# Altium project PiezoControlBoard.PrjPcb (part 1 of 2)
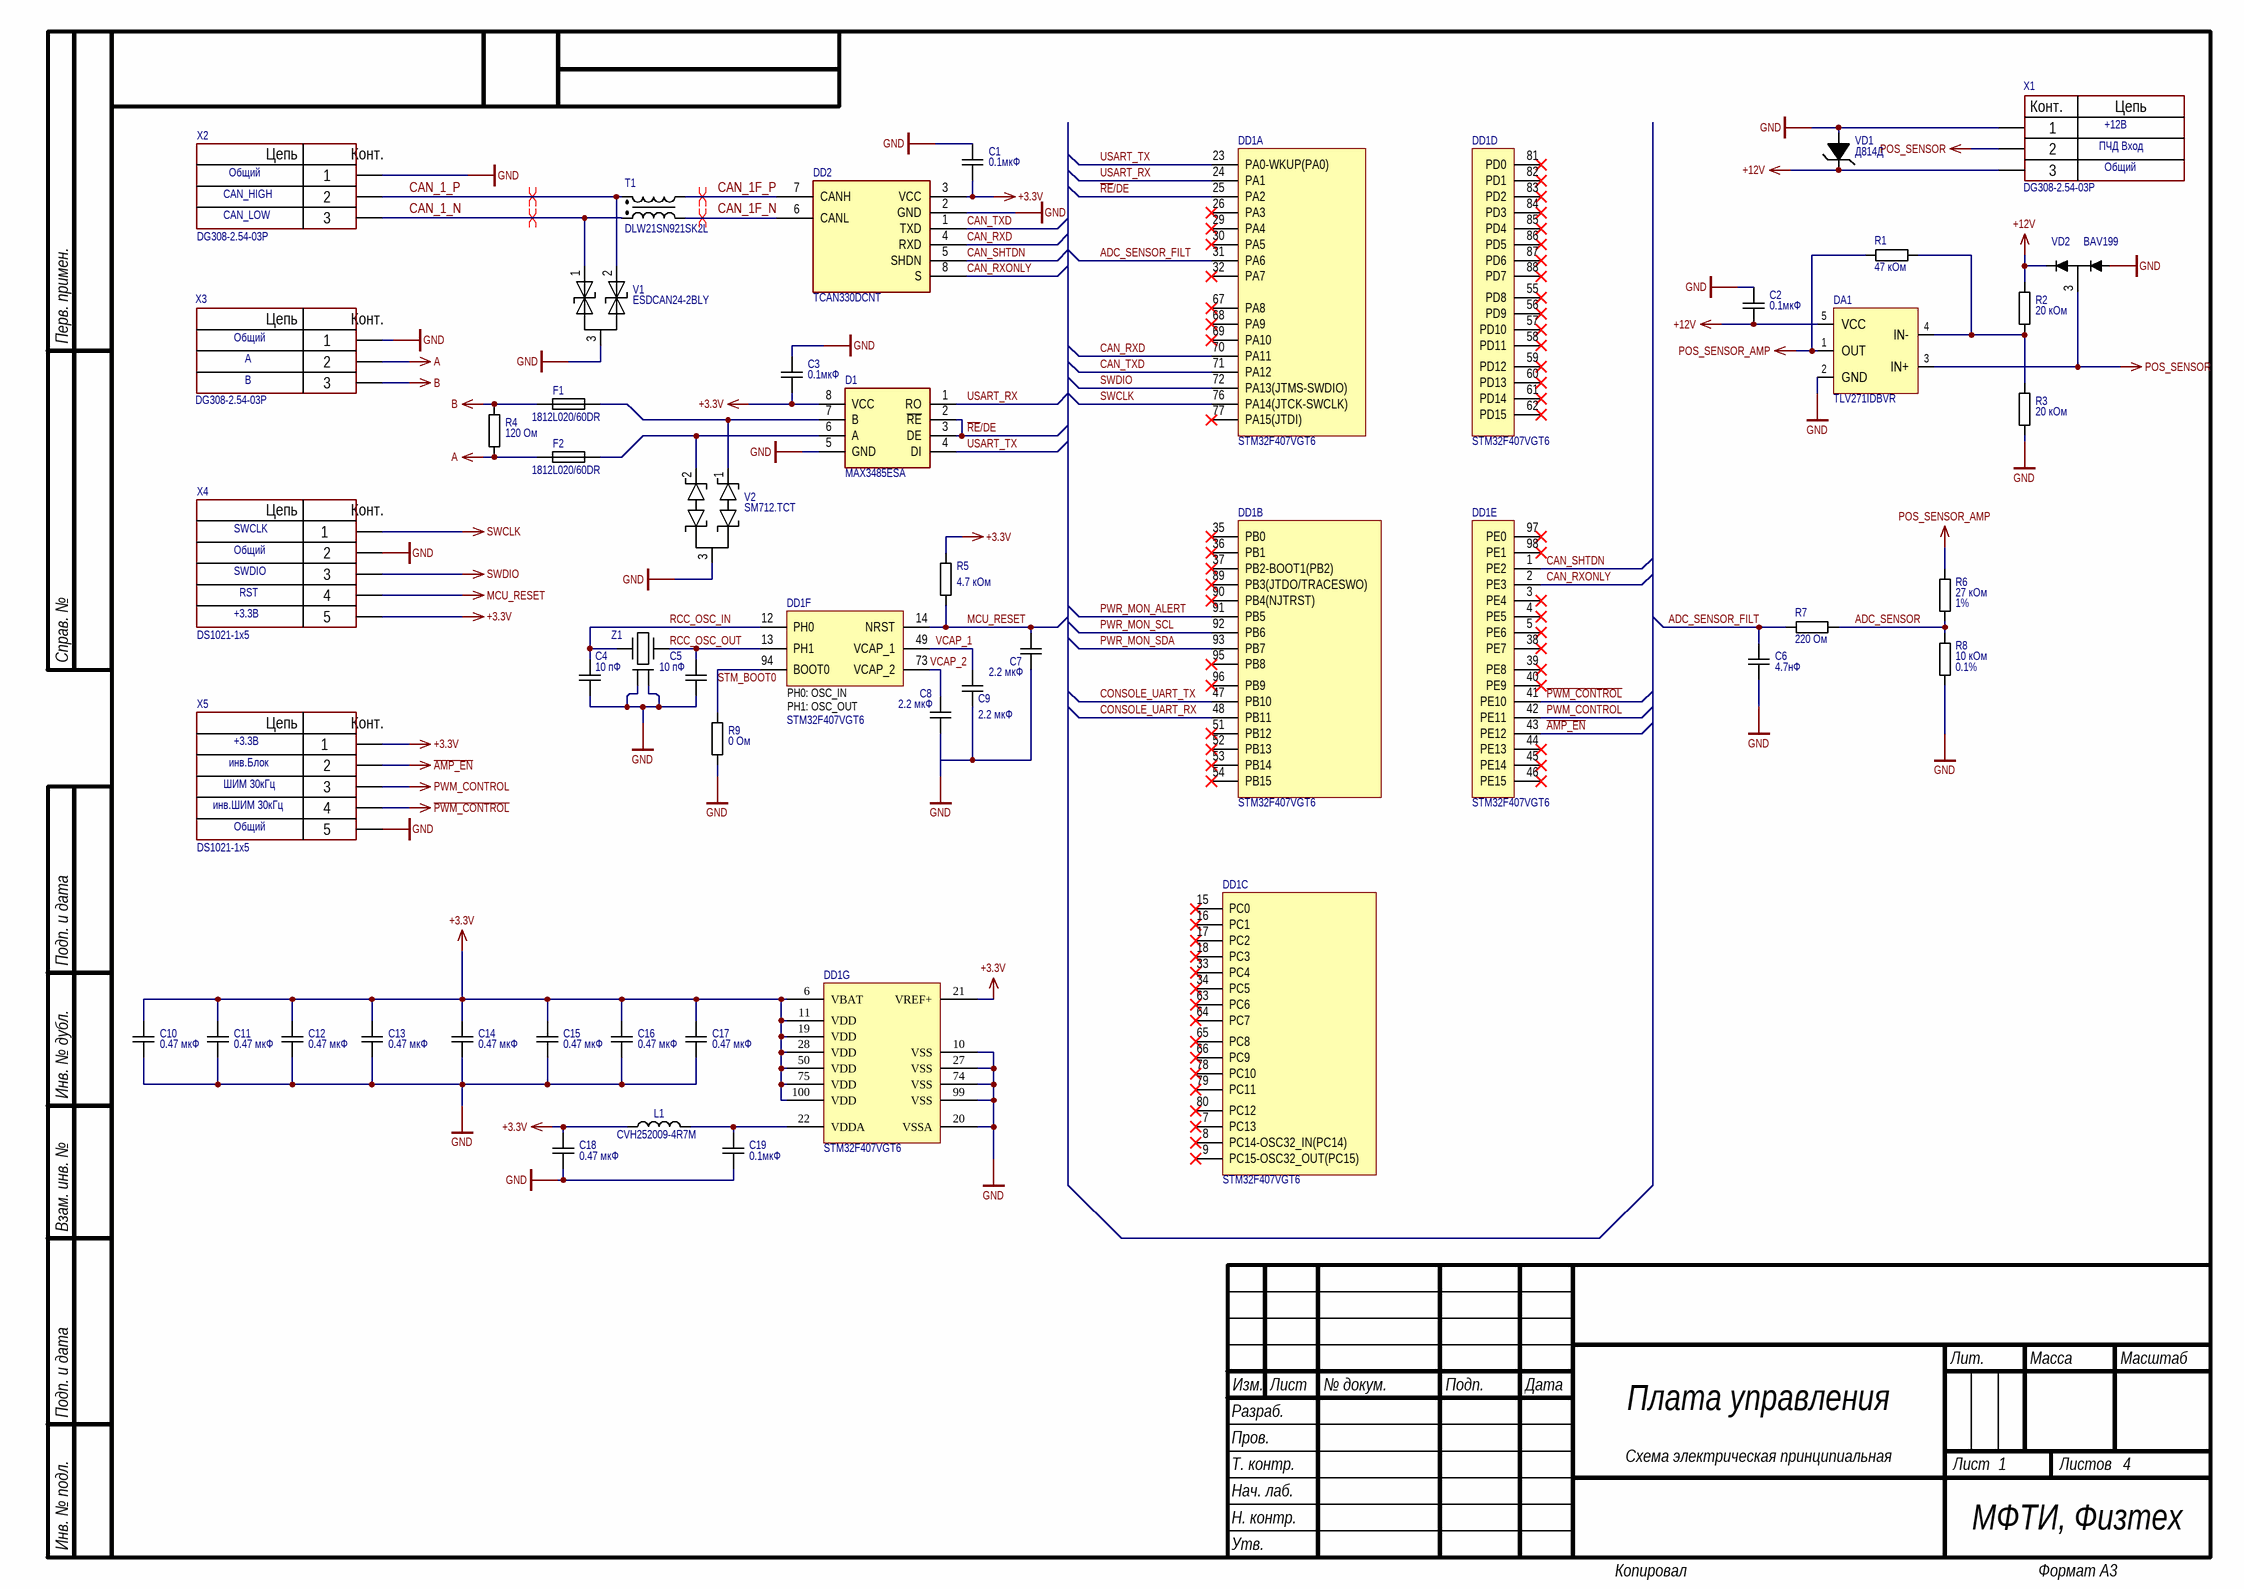
[diagram p0: MCU_Control.SchDoc]
DocumentScale: 2:1
4 sheets, 144 parts. Net scope: global (net labels, ports and power ports of the same name join across sheets).
Board file: PiezoControlBoard.PcbDoc
Sheets:
  MCU_Control.SchDoc
  Power_Management.SchDoc
  HV_Piezo_Driver.SchDoc
  Console.SchDoc

## Sheet MCU_Control.SchDoc: Плата управления
size 419 x 297 mm; Organization: МФТИ, Физтех; SheetNumber: 1; SheetTotal: 4; SchemeType: Схема электрическая принципиальная

### Parts
(Parts that share a designator on the sheet are numbered #1, #2 ... from top to bottom, then left to right.)
C1  value 0.1мкФ  [CAP-0402]  (hidden comment: CAP-0.1мкФ-10%-25В-X7R-0402)
C2  value 0.1мкФ  [CAP-0402]  (hidden comment: CAP-0.1мкФ-10%-25В-X7R-0402)
C3  value 0.1мкФ  [CAP-0402]  (hidden comment: CAP-0.1мкФ-10%-25В-X7R-0402)
C4  value 10 пФ  [CAP-0402]  (hidden comment: CAP-10 пФ-5%-50 В-NP0-0402)
C5  value 10 пФ  [CAP-0402]  (hidden comment: CAP-10 пФ-5%-50 В-NP0-0402)
C6  value 4.7нФ  [CAP-0805]  (hidden comment: CAP-4.7нФ-5%-50В-C0G-0805)
C7  value 2.2 мкФ  [CAP-0603]  (hidden comment: CAP-2.2 мкФ-10%-25 В-X5R-0603)
C8  value 2.2 мкФ  [CAP-0603]  (hidden comment: CAP-2.2 мкФ-10%-25 В-X5R-0603)
C9  value 2.2 мкФ  [CAP-0603]  (hidden comment: CAP-2.2 мкФ-10%-25 В-X5R-0603)
C10  value 0.47 мкФ  [CAP-0402]  (hidden comment: CAP-0.47 мкФ-10%-25 В-X5R-0402)
C11  value 0.47 мкФ  [CAP-0402]  (hidden comment: CAP-0.47 мкФ-10%-25 В-X5R-0402)
C12  value 0.47 мкФ  [CAP-0402]  (hidden comment: CAP-0.47 мкФ-10%-25 В-X5R-0402)
C13  value 0.47 мкФ  [CAP-0402]  (hidden comment: CAP-0.47 мкФ-10%-25 В-X5R-0402)
C14  value 0.47 мкФ  [CAP-0402]  (hidden comment: CAP-0.47 мкФ-10%-25 В-X5R-0402)
C15  value 0.47 мкФ  [CAP-0402]  (hidden comment: CAP-0.47 мкФ-10%-25 В-X5R-0402)
C16  value 0.47 мкФ  [CAP-0402]  (hidden comment: CAP-0.47 мкФ-10%-25 В-X5R-0402)
C17  value 0.47 мкФ  [CAP-0402]  (hidden comment: CAP-0.47 мкФ-10%-25 В-X5R-0402)
C18#1  value 0.47 мкФ  [CAP-0402]  (hidden comment: CAP-0.47 мкФ-10%-25 В-X5R-0402)
C19#1  value 0.1мкФ  [CAP-0402]  (hidden comment: CAP-0.1мкФ-10%-25В-X7R-0402)
D1  MAX3485ESA  [SOIC-8]
DA1  TLV271IDBVR  [SOT-23-5]
DD1  STM32F407VGT6  [LQFP-100]  (parts A,B,C,D,E,F,G of 7)
DD2  TCAN330DCNT  [SOT-23-8]
F1  1812L020/60DR  [SMD-1812]
F2  1812L020/60DR  [SMD-1812]
L1  4.7 мкГн  [IND_1008]  (value not drawn)
R1  value 47 кОм  [RES-0603]  (hidden comment: RES-47 кОм-1%-0.1Вт-0603)
R2  value 20 кОм  [RES-0603]  (hidden comment: RES-20 кОм-1%-0.1Вт-0603)
R3  value 20 кОм  [RES-0603]  (hidden comment: RES-20 кОм-1%-0.1Вт-0603)
R4#1  value 120 Ом  [RES-0402]  (hidden comment: RES-120 Ом-1%-0.062Вт-0402)
R5#1  value 4.7 кОм  [RES-0402]  (hidden comment: RES-4.7 кОм-5%-0.062 Вт-0402)
R6#1  value 27 кОм  Tolerance: 1%  [RES-0603]  (hidden comment: RES-27 кОм-1%-0.1Вт-0603)
R7#1  value 220 Ом  [RES-0603]  (hidden comment: RES-220 Ом-1%-0.1Вт-0603)
R8#1  value 10 кОм  Tolerance: 0.1%  [RES-0603]  (hidden comment: RES-10 кОм-0.1%-0.1Вт-0603)
R9#1  value 0 Ом  [RES-0402]  (hidden comment: RES-0 Ом-5%-0.062 Вт-0402)
T1  DLW21SN921SK2L  [DLW21S]
V1  ESDCAN24-2BLY  [SOT23-3L]
V2  SM712.TCT  [SOT-23]
VD1#1  Д814Д  [КД-8]
VD2#1  BAV199  [SOT-23-3]
X1  DG308-2.54-03P  Curciut 3: +12В  Curciut 2: ПЧД Вход  Curciut 1: Общий  [DG30825403P1400AH]
X2  DG308-2.54-03P  Curciut 3: CAN_LOW  Curciut 2: CAN_HIGH  Curciut 1: Общий  [DG30825403P1400AH]
X3  DG308-2.54-03P  Curciut 3: B  Curciut 2: A  Curciut 1: Общий  [DG30825403P1400AH]
X4  DS1021-1x5  Curciut 5: +3.3В  Curciut 4: RST  Curciut 3: SWDIO  Curciut 2: Общий  Curciut 1: SWCLK  [DS1021-1x5]
X5#1  DS1021-1x5  Curciut 5: Общий  Curciut 4: инв.ШИМ 30кГц  Curciut 3: ШИМ 30кГц  Curciut 2: инв.Блок  Curciut 1: +3.3В  [DS1021-1x5]
Z1  ABM11-25.000MHZ-D2X-T  [ABM11]  (value not drawn)

### Nets
+3.3V: C1.1 C3.1 C10.1 C11.1 C12.1 C13.1 C14.1 C15.1 C16.1 C17.1 C18#1.1 D1.8(VCC) DD1.6(VBAT) DD1.11(VDD) DD1.19(VDD) DD1.21(VREF+) DD1.28(VDD) DD1.50(VDD) DD1.75(VDD) DD1.100(VDD) DD2.3(VCC) L1.1 R5#1.2 X4.5 X5#1.1
+12V: C2.1 DA1.5(VCC) R2.2 VD1#1.C VD2#1.2 X1.3
A: F2.1 R4#1.1 X3.2
~{AMP_EN}: DD1.43(PE12) X5#1.2
B: F1.1 R4#1.2 X3.3
CONSOLE_UART_RX: DD1.48(PB11)
CONSOLE_UART_TX: DD1.47(PB10)
GND: C1.2 C2.2 C3.2 C4.1 C5.1 C6.1 C7.1 C8.1 C9.1 C10.2 C11.2 C12.2 C13.2 C14.2 C15.2 C16.2 C17.2 C18#1.2 C19#1.1 D1.5(GND) DA1.2(GND) DD1.10(VSS) DD1.20(VSSA) DD1.27(VSS) DD1.74(VSS) DD1.99(VSS) DD2.2(GND) R3.1 R8#1.1 R9#1.1 V1.3 V2.3 VD1#1.A VD2#1.1 X1.1 X2.1 X3.1 X4.2 X5#1.5 Z1.2 Z1.4
MCU_RESET: C7.2 DD1.14(NRST) R5#1.1 X4.4
~{PWM_CONTROL}: DD1.41(PE10) X5#1.4
POS_SENSOR: DA1.3(IN+) VD2#1.3 X1.2
POS_SENSOR_AMP: DA1.1(OUT) R1.2 R6#1.2
PWM_CONTROL: DD1.42(PE11) X5#1.3
PWR_MON_ALERT: DD1.91(PB5)
PWR_MON_SCL: DD1.92(PB6)
PWR_MON_SDA: DD1.93(PB7)
SWCLK: DD1.76(PA14(JTCK-SWCLK)) X4.1
SWDIO: DD1.72(PA13(JTMS-SWDIO)) X4.3
~{RE}/DE: D1.2(~{RE}) D1.3(DE) DD1.25(PA2)
ADC_SENSOR: R6#1.1 R7#1.1 R8#1.2
ADC_SENSOR_FILT: C6.2 DD1.31(PA6) R7#1.2
CAN_1_N: T1.1 V1.1 X2.3
CAN_1_P: T1.4 V1.2 X2.2
CAN_1F_N: DD2.6(CANL) T1.2
CAN_1F_P: DD2.7(CANH) T1.3
CAN_RXD: DD1.70(PA11) DD2.4(RXD)
CAN_RXONLY: DD1.2(PE3) DD2.8(S)
CAN_SHTDN: DD1.1(PE2) DD2.5(SHDN)
CAN_TXD: DD1.71(PA12) DD2.1(TXD)
RCC_OSC_IN: C4.2 DD1.12(PH0) Z1.1(OSC1)
RCC_OSC_OUT: C5.2 DD1.13(PH1) Z1.3(OSC2)
STM_BOOT0: DD1.94(BOOT0) R9#1.2
USART_RX: D1.1(RO) DD1.24(PA1)
USART_TX: D1.4(DI) DD1.23(PA0-WKUP(PA0))
VCAP_1: C9.2 DD1.49(VCAP_1)
VCAP_2: C8.2 DD1.73(VCAP_2)
NetC19#1_2: C19#1.2 DD1.22(VDDA) L1.2
NetD1_6: D1.6(A) F2.2 V2.2
NetD1_7: D1.7(B) F1.2 V2.1
NetDA1_4: DA1.4(IN-) R1.1 R2.1 R3.2

Not connected (* = marked no-connect by the designer): DD1 3(PE4)* 4(PE5)* 5(PE6)* 7(PC13)* 8(PC14-OSC32_IN(PC14))* 9(PC15-OSC32_OUT(PC15))* 15(PC0)* 16(PC1)* 17(PC2)* 18(PC3)* 26(PA3)* 29(PA4)* 30(PA5)* 32(PA7)* 33(PC4)* 34(PC5)* 35(PB0)* 36(PB1)* 37(PB2-BOOT1(PB2))* 38(PE7)* 39(PE8)* 40(PE9)* 44(PE13)* 45(PE14)* 46(PE15)* 51(PB12)* 52(PB13)* 53(PB14)* 54(PB15)* 55(PD8)* 56(PD9)* 57(PD10)* 58(PD11)* 59(PD12)* 60(PD13)* 61(PD14)* 62(PD15)* 63(PC6)* 64(PC7)* 65(PC8)* 66(PC9)* 67(PA8)* 68(PA9)* 69(PA10)* 77(PA15(JTDI))* 78(PC10)* 79(PC11)* 80(PC12)* 81(PD0)* 82(PD1)* 83(PD2)* 84(PD3)* 85(PD4)* 86(PD5)* 87(PD6)* 88(PD7)* 89(PB3(JTDO/TRACESWO))* 90(PB4(NJTRST))* 95(PB8)* 96(PB9)* 97(PE0)* 98(PE1)*

### Layout directives
differential pair: CAN_1_N, CAN_1_P, CAN_1F_N, CAN_1F_P

### Notes on the sheet
- Перв. примен.
- Справ. №
- Подп. и дата
- Инв. № дубл.
- Взам. инв. №
- Разраб.
- Изм.
- Лист
- № докум.
- Подп.
- Дата
- Лит.
- Масса
- Масштаб
- Пров.
- Т. контр.
- Листов
- Н. контр.
- Утв.
- Нач. лаб.
- Инв. № подл.
- Копировал
- Формат А3
- (in symbol DG308-2.54-03P) Цепь; Конт.
- (in symbol DS1021-1x5) Цепь; Конт.
- (in symbol STM32F407VGT6, part F) PH0: OSC_IN; PH1: OSC_OUT

### Library data of the parts
C1-C3 C19#1 = Cap_0402: Конденсатор; Manufacturer Part Number: GRM155R71E104KE14D; Tolerance: 10%; Voltage: 25В; Supplier 1: https://www.chipdip.ru/product/grm155r71e104ke14d-murata; Temperature: X7R
C4 C5 = Cap_0402: Конденсатор; Manufacturer Part Number: GRM1535C1H100JDD5D; Tolerance: 5%; Voltage: 50 В; Supplier 1: https://www.chipdip.ru/product/grm1535c1h100j; Temperature: NP0
C6 = Cap_0805: Конденсатор; Manufacturer Part Number: GRM2165C1H472JA01D; Tolerance: 5%; Voltage: 50В; Temperature: C0G; Supplier 1: https://www.chipdip.ru/product/grm2165c1h472ja01d-kondensator-keramicheskiy-mlcc-murata-8016016109
C7-C9 = Cap_0603: Конденсатор; Manufacturer Part Number: GRM188R61E225KA12D; Tolerance: 10%; Voltage: 25 В; Temperature: X5R; Supplier 1: https://www.chipdip.ru/product/grm188r61e225ka12d-murata
C10-C17 C18#1 = Cap_0402: Конденсатор керамический 25 В, 0.47 мкФ ±10%, X5R, 0402, -55...85 °C; Manufacturer Part Number: GRT155R61E474KE01D; Voltage: 25 В; Supplier 1: https://www.chipdip.ru/product/grm21br71e474k; Tolerance: 10%; Temperature: X5R
D1 = MAX3485ESA+: Single Transmitter/Receiver RS-422/RS-485 8-Pin SOIC N; Manufacturer: Maxim; Supplier 1: https://www.chipdip.ru/product/max3485eesa-t-maxim; Supplier Part Number: 2518818; Manufacturer Part Number: MAX3485ESA+; RoHS: Yes; Category: RS-232 / RS-422 / RS-485 Interface ICs; Stock: 707; Pricing: 1=6,17, 10=5,32, 25=4,97, 100=4,61, 300=4,41, 500=4,01, 1000=3,52 (EUR); ComponentLink1URL: https://datasheet.ciiva.com/14424/max3483-max3491-14424938.pdf?src-supplier=Avnet; ComponentLink1Description: https://datasheet.ciiva.com/14424/max3483-max3491-14424938.pdf?src-supplier=Avnet; ComponentLink2URL: https://datasheet.ciiva.com/1714/max3483-max3491-1714122.pdf?src-supplier=Digikey; ComponentLink2Description: https://datasheet.ciiva.com/1714/max3483-max3491-1714122.pdf?src-supplier=Digikey
DA1 = TLV271IDBVR: Single Rail-to-Rail Operational Amplifier, SOT-23, TLV271IDBVR; Manufacturer: Texas Instruments; Manufacturer Lifecycle Status: ACTIVE; Bandwidth: 3MHz; Common Mode Rejection Ratio: 69dB; Dual Supply Voltage: 5V; Input Bias Current: 60pA; Input Offset Voltage (Vos): 5mV; Max Dual Supply Voltage: 8V; Max Power Dissipation: 201mW; Max Supply Voltage: 16V; Min Dual Supply Voltage: 1.35V; Min Supply Voltage: 2.7V; Nominal Supply Current: 800µA; Number of Amplifiers: 1; Operating Supply Current: 625µA; Output Current: 13mA; Power Supply Rejection Ratio (PSRR): 70dB; Slew Rate: 2.4V/µs; Voltage Gain: 110dB; Supplier: RS; Supplier Part Number: 2184654; Manufacturer Part Number: TLV271IDBVR; RoHS: Compliant; Category: Amplifiers - Op Amps, Buffer, Instrumentation; Stock: 1000; Pricing: 10=0,505, 50=0,479, 100=0,432, 250=0,388, 500=0,369 (GBP); Case/Package: SOT-23; Contact Plating: Gold; Gain Bandwidth Product: 3MHz; Height: 1.45mm; Lead Free: Lead Free; Length: 2.9mm; Lifecycle Status: Production; Max I/O Voltage: 5mV; Max Operating Temperature: 125°C; Min Operating Temperature: -40°C; Nominal Gain Bandwidth Product: 3MHz; Number of Channels: 1; Number of Circuits: 1; Number of Elements: 1; Pins: 5; Operating Supply Voltage: 5V; Output Current per Channel: 13mA; Packaging: Cut Tape; Power Dissipation: 201mW; Radiation Hardening: No; REACH SVHC: No; Schedule B: 8542330000, 8542330000|8542330000|8542330000|8542330000|8542330000|8542330000|8542330000|8542330000|8542330000|8542330000|8542330000|8542330000|8542330000|8542330000|8542330000|8542330000|8542330000|8542330000|8542330000|8542330000|8542330000|8542330000|8542330000|85; Thickness: 1.2mm; Width: 1.6mm; ComponentLink1URL: https://sigma.octopart.com:443/177332311/technical_drawing/Texas-Instruments-TLV271IDBVR.pdf?src-supplier=Texas+Instruments; ComponentLink1Description: https://sigma.octopart.com:443/177332311/technical_drawing/Texas-Instruments-TLV271IDBVR.pdf?src-supplier=Texas+Instruments; ComponentLink2URL: https://octopart.com:443/opatz8j6/c1?t=xcKfiJBWjAmYsTfbSL-CzoOmzwEvjnPfYfSv82HYzKGs_6IgCZ6Y4Z1lF1bvJzEv39QWfXGgcZZnnapJK-Oyrd-ym6EThaYOJfbjIdY0gNOgQgkvB5ipi4TQKB-N_9Z4aF8oC4FEWWO1qQbGN_gEN6aHITD1x1gqD40gQs_ZLOpQbD32bAUiak8d48dFHYI_buWggoNQNLuwFJQIcVLm9iYp2q-f2WXUrehkCiEZXZGpi4kEl-P_ikKun8CbEnyYrMhl2WVMGYe1UiE5g9ZjThNOC2j0NOontvZ9pDSM0E2NdS-KvLoF94xRgWqBDz3UjNI_t0gqBymYZUMiW6_Jo37IGL5BO-oa7doWszXX2JJOG4V0X3qSIiHL2dBw451RtRk&src-supplier=Texas+Instruments; ComponentLink2Description: https://octopart.com:443/opatz8j6/c1?t=xcKfiJBWjAmYsTfbSL-CzoOmzwEvjnPfYfSv82HYzKGs_6IgCZ6Y4Z1lF1bvJzEv39QWfXGgcZZnnapJK-Oyrd-ym6EThaYOJfbjIdY0gNOgQgkvB5ipi4TQKB-N_9Z4aF8oC4FEWWO1qQbGN_gEN6aHITD1x1gqD40gQs_ZLOpQbD32bAUiak8d48dFHYI_buWggoNQNLuwFJQIcVLm9iYp2q-f2WXUrehkCiEZXZGpi4kEl-P_ikKun8CbEnyYrMhl2WVMGYe1UiE5g9ZjThNOC2j0NOontvZ9pDSM0E2NdS-KvLoF94xRgWqBDz3UjNI_t0gqBymYZUMiW6_Jo37IGL5BO-oa7doWszXX2JJOG4V0X3qSIiHL2dBw451RtRk&src-supplier=Texas+Instruments; ComponentLink3URL: https://sigma.octopart.com:443/175570406/technical_drawing/Texas-Instruments-TLV271IDBVR.pdf?src-supplier=Texas+Instruments; ComponentLink3Description: https://sigma.octopart.com:443/175570406/technical_drawing/Texas-Instruments-TLV271IDBVR.pdf?src-supplier=Texas+Instruments; ComponentLink4URL: https://sigma.octopart.com:443/169406034/technical_drawing/Texas-Instruments-TLV271IDBVR.pdf?src-supplier=Texas+Instruments; ComponentLink4Description: https://sigma.octopart.com:443/169406034/technical_drawing/Texas-Instruments-TLV271IDBVR.pdf?src-supplier=Texas+Instruments; ComponentLink5URL: https://sigma.octopart.com:443/155939316/technical_drawing/Texas-Instruments-TLV271IDBVR.pdf?src-supplier=Texas+Instruments; ComponentLink5Description: https://sigma.octopart.com:443/155939316/technical_drawing/Texas-Instruments-TLV271IDBVR.pdf?src-supplier=Texas+Instruments; ComponentLink6URL: https://sigma.octopart.com:443/102331370/technical_drawing/Texas-Instruments-TLV271IDBVR.pdf?src-supplier=Texas+Instruments; ComponentLink6Description: https://sigma.octopart.com:443/102331370/technical_drawing/Texas-Instruments-TLV271IDBVR.pdf?src-supplier=Texas+Instruments; ComponentLink7URL: https://sigma.octopart.com:443/49249325/technical_drawing/Texas-Instruments-TLV271IDBVR.pdf?src-supplier=Texas+Instruments; ComponentLink7Description: https://sigma.octopart.com:443/49249325/technical_drawing/Texas-Instruments-TLV271IDBVR.pdf?src-supplier=Texas+Instruments; ComponentLink8URL: https://datasheet.octopart.com:443/TLV271IDBVR-Texas-Instruments-datasheet-151134.pdf?src-supplier=Texas+Instruments; ComponentLink8Description: https://datasheet.octopart.com:443/TLV271IDBVR-Texas-Instruments-datasheet-151134.pdf?src-supplier=Texas+Instruments; ComponentLink9URL: https://datasheet.octopart.com:443/TLV271IDBVR-Texas-Instruments-datasheet-11536657.pdf?src-supplier=Upverter; ComponentLink9Description: https://datasheet.octopart.com:443/TLV271IDBVR-Texas-Instruments-datasheet-11536657.pdf?src-supplier=Upverter; ComponentLink10URL: https://datasheet.octopart.com:443/TLV271IDBVR.-Texas-Instruments-datasheet-66581739.pdf?src-supplier=element14+APAC; ComponentLink10Description: https://datasheet.octopart.com:443/TLV271IDBVR.-Texas-Instruments-datasheet-66581739.pdf?src-supplier=element14+APAC; ComponentLink11URL: https://datasheet.octopart.com:443/TLV271IDBVR.-Texas-Instruments-datasheet-62088949.pdf?src-supplier=element14+APAC; ComponentLink11Description: https://datasheet.octopart.com:443/TLV271IDBVR.-Texas-Instruments-datasheet-62088949.pdf?src-supplier=element14+APAC; ComponentLink12URL: https://datasheet.octopart.com:443/TLV271IDBVR.-Texas-Instruments-datasheet-37735837.pdf?src-supplier=Farnell; ComponentLink12Description: https://datasheet.octopart.com:443/TLV271IDBVR.-Texas-Instruments-datasheet-37735837.pdf?src-supplier=Farnell; ComponentLink13URL: https://datasheet.octopart.com:443/TLV271IDBVR-Texas-Instruments-datasheet-32026764.pdf?src-supplier=Farnell; ComponentLink13Description: https://datasheet.octopart.com:443/TLV271IDBVR-Texas-Instruments-datasheet-32026764.pdf?src-supplier=Farnell; ComponentLink14URL: https://datasheet.octopart.com:443/TLV271IDBVR-Texas-Instruments-datasheet-164418874.pdf?src-supplier=SHENGYU+ELECTRONICS; ComponentLink14Description: https://datasheet.octopart.com:443/TLV271IDBVR-Texas-Instruments-datasheet-164418874.pdf?src-supplier=SHENGYU+ELECTRONICS; ComponentLink15URL: https://datasheet.octopart.com:443/TLV271IDBVR-Texas-Instruments-datasheet-164361764.pdf?src-supplier=LCSC; ComponentLink15Description: https://datasheet.octopart.com:443/TLV271IDBVR-Texas-Instruments-datasheet-164361764.pdf?src-supplier=LCSC; ComponentLink16URL: https://datasheet.octopart.com:443/TLV271IDBVR-Texas-Instruments-datasheet-159117792.pdf?src-supplier=LCSC; ComponentLink16Description: https://datasheet.octopart.com:443/TLV271IDBVR-Texas-Instruments-datasheet-159117792.pdf?src-supplier=LCSC; ComponentLink17URL: https://datasheet.octopart.com:443/TLV271IDBVR-Texas-Instruments-datasheet-169977755.pdf?src-supplier=Burklin+Elektronik; ComponentLink17Description: https://datasheet.octopart.com:443/TLV271IDBVR-Texas-Instruments-datasheet-169977755.pdf?src-supplier=Burklin+Elektronik; ComponentLink18URL: https://datasheet.octopart.com:443/TLV271IDBVR-Texas-Instruments-datasheet-14138263.pdf?src-supplier=iiiC; ComponentLink18Description: https://datasheet.octopart.com:443/TLV271IDBVR-Texas-Instruments-datasheet-14138263.pdf?src-supplier=iiiC; ComponentLink19URL: https://datasheet.octopart.com:443/TLV271IDBVR-Texas-Instruments-datasheet-16079680.pdf?src-supplier=Factory+Futures; ComponentLink19Description: https://datasheet.octopart.com:443/TLV271IDBVR-Texas-Instruments-datasheet-16079680.pdf?src-supplier=Factory+Futures; ComponentLink20URL: https://datasheet.octopart.com:443/TLV271IDBVR-Texas-Instruments-datasheet-8443790.pdf?src-supplier=Jameco; ComponentLink20Description: https://datasheet.octopart.com:443/TLV271IDBVR-Texas-Instruments-datasheet-8443790.pdf?src-supplier=Jameco; ComponentLink21URL: https://datasheet.octopart.com:443/TLV271IDBVR-Texas-Instruments-datasheet-57216.pdf?src-supplier=DigiKey; ComponentLink21Description: https://datasheet.octopart.com:443/TLV271IDBVR-Texas-Instruments-datasheet-57216.pdf?src-supplier=DigiKey; ComponentLink22URL: https://datasheet.octopart.com:443/TLV271IDBVR-Texas-Instruments-datasheet-17699.pdf?src-supplier=Sierra+IC; ComponentLink22Description: https://datasheet.octopart.com:443/TLV271IDBVR-Texas-Instruments-datasheet-17699.pdf?src-supplier=Sierra+IC; ComponentLink23URL: http://sigma.octopart.com:80/reach_statement/Texas-Instruments-company-64.pdf?src-supplier=Compliance+Statements; ComponentLink23Description: http://sigma.octopart.com:80/reach_statement/Texas-Instruments-company-64.pdf?src-supplier=Compliance+Statements; ComponentLink24URL: http://sigma.octopart.com:80/conflict_mineral_statement/Texas-Instruments-company-63.pdf?src-supplier=Compliance+Statements; ComponentLink24Description: http://sigma.octopart.com:80/conflict_mineral_statement/Texas-Instruments-company-63.pdf?src-supplier=Compliance+Statements; Supplier 1: https://www.chipdip.ru/product/tlv271idbvr-texas-instruments-8001838236
DD1 = STM32F407VGT6: MCU 32-bit STM32F ARM Cortex M4F RISC 1024KB Flash 2.5V/3.3V 100-Pin LQFP Tray; Manufacturer: STMicroelectronics; Number of UART Channels: 2; Max Supply Voltage: 3.6V; Min Supply Voltage: 1.8V; Number of SPI Channels: 3; Interface: I2C,SPI,USB,CAN,Ethernet,IrDA,UART,USART,LIN,EBI/EMI,I2S; Number of Timers/Counters: 14; RAM Size: 196KB; Number of ADC Channels: 16; Number of Ethernet Channels: 1; Data Bus Width: 32b; Nominal Supply Current: 1.7uA; Number of A/D Converters: 3NUMBER; Number of Channels: 16NUMBER; Number of D/A Converters: 2NUMBER; Number of USB Channels: 1NUMBER; Number of I/Os: 82; Frequency: 168MHz; Oscillator Type: Internal; Watchdog Timer: Yes; Peripherals: Brown-out Detect/Reset,POR,PWM,WDT,DMA,LCD,I2C; Supplier 1: https://www.chipdip.ru/product/stm32f407vgt6; Supplier Part Number: 7468226; Manufacturer Part Number: STM32F407VGT6; RoHS: Yes; Category: Microcontrollers; Stock: 813; Pricing: 1=10,95, 10=10,07, 25=9,66, 100=8,5, 250=8,28 (GBP); Case/Package: LQFP; Pins: 100; Min Operating Temperature: -40°C; Max Operating Temperature: 85°C; Number of I2C Channels: 3; Packaging: Tray; Memory Format: FLASH; Memory Size: 1024KB; Core Architecture: ARM; Package Quantity: 90; Number of PWM Channels: 2; Number of Programmable I/O: 82; Clock Frequency: 168MHz; Address Bus Width: 32b; Series: STM32 F4; Length: 14.2mm; Width: 14.2mm; Height: 1.45mm; Radiation Hardening: No; Lead Free: Lead Free; Reach SVHC Compliant: No; RoHS Compliant: Yes; ComponentLink1URL: https://datasheet.ciiva.com/14132/stm32f407vgt6-tds-eng-14132567.pdf?src-supplier=Distrelec; ComponentLink1Description: https://datasheet.ciiva.com/14132/stm32f407vgt6-tds-eng-14132567.pdf?src-supplier=Distrelec; ComponentLink2URL: https://datasheet.ciiva.com/4842/dm00037051-492832-4842280.pdf?src-supplier=Mouser; ComponentLink2Description: https://datasheet.ciiva.com/4842/dm00037051-492832-4842280.pdf?src-supplier=Mouser; ComponentLink3URL: https://datasheet.ciiva.com/48687/001075599-da-01-en-mcu-32bt-1mb-stm32f407vgt6-lqfp-100-stm-48687547.pdf?src-supplier=Conrad; ComponentLink3Description: https://datasheet.ciiva.com/48687/001075599-da-01-en-mcu-32bt-1mb-stm32f407vgt6-lqfp-100-stm-48687547.pdf?src-supplier=Conrad
DD2 = TCAN330DCNT: EAR99 TCAN330 Tape & Reel (TR) CANbus interface transceiver 3.3V 1.45mm 1Mbps -40C~125C; Manufacturer: Texas Instruments; Supplier 1: https://www.chipdip.ru/product0/8005011845; Manufacturer Part Number: TCAN330DCNT; RoHS: Yes; Category: Interface ICs; Stock 1: 49; Pricing 1: 1=2,386, 10=1,915, 25=1,65 (USD); Length: 2.9mm; Width: 1.63mm; Height: 1.45mm; Thickness: 1.1mm; ComponentLink1URL: http://www.ti.com/lit/ds/symlink/tcan330.pdf?src-supplier=Digikey; ComponentLink1Description: http://www.ti.com/lit/ds/symlink/tcan330.pdf?src-supplier=Digikey; ComponentLink2URL: http://www.ti.com/general/docs/suppproductinfo.tsp?distId=10&amp;gotoUrl=http%3A%2F%2Fwww.ti.com%2Flit%2Fgpn%2Ftcan330&src-supplier=Digikey; ComponentLink2Description: http://www.ti.com/general/docs/suppproductinfo.tsp?distId=10&amp;gotoUrl=http%3A%2F%2Fwww.ti.com%2Flit%2Fgpn%2Ftcan330&src-supplier=Digikey; ComponentLink3URL: http://www.ti.com/general/docs/lit/getliterature.tsp?genericPartNumber=TCAN330&amp;&amp;fileType=pdf&src-supplier=Farnell; ComponentLink3Description: http://www.ti.com/general/docs/lit/getliterature.tsp?genericPartNumber=TCAN330&amp;&amp;fileType=pdf&src-supplier=Farnell; ComponentLink4URL: http://www.ti.com/general/docs/lit/getliterature.tsp?genericPartNumber=TCAN330&&fileType=pdf&src-supplier=Element14; ComponentLink4Description: http://www.ti.com/general/docs/lit/getliterature.tsp?genericPartNumber=TCAN330&&fileType=pdf&src-supplier=Element14; Supplier Part Number 1: TCAN330DCNT
F1 F2 = 1812L020/60DR: PTC Resettable Fuse 0.2A(hold) 0.4A(trip) 60VDC 40A 0.8W 0.02s 0.8Ohm SMD Solder Pad 1812 T/R; Manufacturer: Littelfuse; Approvals: TUV, cULus; Hold Current: 200mA; Maximum Resistance 1 Hour (R1max): 4.4Ω; Max Voltage Rating (DC): 30V; Minimum Resistance Initial (Rmin): 1.4Ω; Power Dissipation: 800mW; Time to Trip: 2s; Trip Current: 400mA; Working Voltage: 60V; Manufacturer Part Number: 1812L020/60DR; RoHS: Compliant; Category: PTC Resettable Fuses; Pricing 1: 1500=0,187, 3000=0,185, 6000=0,182, 22500=0,177 (USD); Case/Package: 1812; Case Code (Imperial): 1812; Case Code (Metric): 4532; Country of Origin: Taiwan; Export Control Classification Number (ECCN) Code: EAR99; Height: 1.25mm; Harmonized Tariff Schedule (HTS) Code: 8533.40.80.70; Introduction Date: 2012-08-07; Lead Free: Lead Free; Lifecycle Status: Production; Max Current Rating: 40A; Max Operating Temperature: 85°C; Min Operating Temperature: -40°C; Mount: Surface Mount; Number of Terminals: 2; Packaging: Tape & Reel (TR); REACH SVHC: Yes; Resistance: 1.4Ω; Termination: SMD/SMT; Width: 3.41mm; ComponentLink1URL: https://datasheet.octopart.com:443/1812L020-60DR-Littelfuse-datasheet-181956373.pdf?src-supplier=IHS; ComponentLink1Description: https://datasheet.octopart.com:443/1812L020-60DR-Littelfuse-datasheet-181956373.pdf?src-supplier=IHS; ComponentLink2URL: https://datasheet.octopart.com:443/1812L020-60DR-Littelfuse-datasheet-165518607.pdf?src-supplier=Farnell; ComponentLink2Description: https://datasheet.octopart.com:443/1812L020-60DR-Littelfuse-datasheet-165518607.pdf?src-supplier=Farnell; ComponentLink3URL: https://datasheet.octopart.com:443/1812L020-60DR-Littelfuse-datasheet-95953547.pdf?src-supplier=Farnell; ComponentLink3Description: https://datasheet.octopart.com:443/1812L020-60DR-Littelfuse-datasheet-95953547.pdf?src-supplier=Farnell; ComponentLink4URL: https://datasheet.octopart.com:443/1812L020-60DR-Littelfuse-datasheet-81917122.pdf?src-supplier=Farnell; ComponentLink4Description: https://datasheet.octopart.com:443/1812L020-60DR-Littelfuse-datasheet-81917122.pdf?src-supplier=Farnell; ComponentLink5URL: https://datasheet.octopart.com:443/1812L020-60DR-Littelfuse-datasheet-133510347.pdf?src-supplier=TME; ComponentLink5Description: https://datasheet.octopart.com:443/1812L020-60DR-Littelfuse-datasheet-133510347.pdf?src-supplier=TME; ComponentLink6URL: https://datasheet.octopart.com:443/1812L020-60DR-Littelfuse-datasheet-183575728.pdf?src-supplier=Sager+Electronics; ComponentLink6Description: https://datasheet.octopart.com:443/1812L020-60DR-Littelfuse-datasheet-183575728.pdf?src-supplier=Sager+Electronics; ComponentLink7URL: https://datasheet.octopart.com:443/1812L020-60DR-Littelfuse-datasheet-175882318.pdf?src-supplier=Sager+Electronics; ComponentLink7Description: https://datasheet.octopart.com:443/1812L020-60DR-Littelfuse-datasheet-175882318.pdf?src-supplier=Sager+Electronics; ComponentLink8URL: https://datasheet.octopart.com:443/1812L020-60DR-Littelfuse-datasheet-177174290.pdf?src-supplier=Burklin+Elektronik; ComponentLink8Description: https://datasheet.octopart.com:443/1812L020-60DR-Littelfuse-datasheet-177174290.pdf?src-supplier=Burklin+Elektronik; ComponentLink9URL: https://datasheet.octopart.com:443/1812L020-60DR-Littelfuse-datasheet-24577145.pdf?src-supplier=Future+Electronics; ComponentLink9Description: https://datasheet.octopart.com:443/1812L020-60DR-Littelfuse-datasheet-24577145.pdf?src-supplier=Future+Electronics; ComponentLink10URL: https://datasheet.octopart.com:443/1812L020-60DR-Littelfuse-datasheet-11773851.pdf?src-supplier=Fuses+Unlimited; ComponentLink10Description: https://datasheet.octopart.com:443/1812L020-60DR-Littelfuse-datasheet-11773851.pdf?src-supplier=Fuses+Unlimited; ComponentLink11URL: https://datasheet.octopart.com:443/1812L020-60DR-Littelfuse-datasheet-10288713.pdf?src-supplier=Fuses+Unlimited; ComponentLink11Description: https://datasheet.octopart.com:443/1812L020-60DR-Littelfuse-datasheet-10288713.pdf?src-supplier=Fuses+Unlimited; ComponentLink12URL: https://datasheet.octopart.com:443/1812L020-60DR-Littelfuse-datasheet-8764218.pdf?src-supplier=Fuses+Unlimited; ComponentLink12Description: https://datasheet.octopart.com:443/1812L020-60DR-Littelfuse-datasheet-8764218.pdf?src-supplier=Fuses+Unlimited; ComponentLink13URL: https://datasheet.octopart.com:443/1812L020-60DR-Littelfuse-datasheet-8701984.pdf?src-supplier=Fuses+Unlimited; ComponentLink13Description: https://datasheet.octopart.com:443/1812L020-60DR-Littelfuse-datasheet-8701984.pdf?src-supplier=Fuses+Unlimited; ComponentLink14URL: https://datasheet.octopart.com:443/1812L020-60DR-Littelfuse-datasheet-8499982.pdf?src-supplier=Fuses+Unlimited; ComponentLink14Description: https://datasheet.octopart.com:443/1812L020-60DR-Littelfuse-datasheet-8499982.pdf?src-supplier=Fuses+Unlimited; ComponentLink15URL: https://datasheet.octopart.com:443/1812L020-60DR-Littelfuse-datasheet-8330599.pdf?src-supplier=Fuses+Unlimited; ComponentLink15Description: https://datasheet.octopart.com:443/1812L020-60DR-Littelfuse-datasheet-8330599.pdf?src-supplier=Fuses+Unlimited; ComponentLink16URL: https://datasheet.octopart.com:443/1812L020-60DR-Littelfuse-datasheet-560439.pdf?src-supplier=Fuses+Unlimited; ComponentLink16Description: https://datasheet.octopart.com:443/1812L020-60DR-Littelfuse-datasheet-560439.pdf?src-supplier=Fuses+Unlimited; Supplier Part Number 1: 9134053; Supplier 1: https://www.chipdip.ru/product/1812l020-60dr-0.2a-60v-predohranitel-littelfuse-9000254948?from=similar_product_auto; Supplier: Future Electronics
L1 = CVH252009-4R7M: Inductor Power Chip Shielded Multi-Layer 4.7uH 20% 1MHz Ferrite 1.1A 110mOhm DCR 1008 T/R; Manufacturer: Bourns; Supplier: Rs; Supplier Part Number: 1808878; Manufacturer Part Number: CVH252009-4R7M; RoHS: Yes; Category: Fixed Inductors; Stock: 495; Pricing: 3000=25,352 (RUB); ComponentLink1URL: https://datasheet.ciiva.com/8003/1610598-8003733.pdf?src-supplier=Element14; ComponentLink1Description: https://datasheet.ciiva.com/8003/1610598-8003733.pdf?src-supplier=Element14; ComponentLink2URL: https://datasheet.ciiva.com/7849/1610598-7849319.pdf?src-supplier=Element14; ComponentLink2Description: https://datasheet.ciiva.com/7849/1610598-7849319.pdf?src-supplier=Element14; ComponentLink3URL: https://datasheet.ciiva.com/22874/70301233-22874397.pdf?src-supplier=Allied+Electronics; ComponentLink3Description: https://datasheet.ciiva.com/22874/70301233-22874397.pdf?src-supplier=Allied+Electronics; ComponentLink4URL: https://datasheet.ciiva.com/3079/cvh-3079748.pdf?src-supplier=Avnet; ComponentLink4Description: https://datasheet.ciiva.com/3079/cvh-3079748.pdf?src-supplier=Avnet; Supplier 1: https://www.chipdip.ru/product0/8002027222
R1 = Res_0603: Резистор; Manufacturer Part Number: RC0603FR-0747KL; Power: 0.1Вт; Tolerance: 1%; Supplier 1: https://www.chipdip.ru/product/0.1vt-0603-47-kom-1-rc0603fr-0747kl-chip-rezistor-smd-yageo-9000260524
R2 R3 = Res_0603: Резистор; Manufacturer Part Number: RC0603FR-0720KL; Power: 0.1Вт; Tolerance: 1%; Supplier 1: https://www.chipdip.ru/product/0.1vt-0603-20-kom-1-rc0603fr-0720kl-chip-rezistor-smd-yageo-9000396126
R4#1 = Res_0402: Резистор; Manufacturer Part Number: RC0402FR-07120RL; Tolerance: 1%; Power: 0.062Вт; Supplier 1: https://www.chipdip.ru/product/0.062w-0402-120-om-1
R5#1 = Res_0402: Резистор; Manufacturer Part Number: RC0402JR-074K7L; Tolerance: 5%; Power: 0.062 Вт; Supplier 1: https://www.chipdip.ru/product/0.062w-0402-4.7-kom-5
R6#1 = Res_0603: Резистор; Manufacturer Part Number: RC0603FR-0727KL; Power: 0.1Вт; Supplier 1: https://www.chipdip.ru/product/0.1vt-0603-27-kom-1-rc0603fr-0727kl-chip-rezistor-smd-yageo-9000339200
R7#1 = Res_0603: Резистор; Manufacturer Part Number: RC0603FR-07220RL; Power: 0.1Вт; Tolerance: 1%; Supplier 1: https://www.chipdip.ru/product/0.1vt-0603-220-om-1-rc0603fr-07220rl-chip-rezistor-yageo-9000179829
R8#1 = Res_0603: Резистор; Manufacturer Part Number: RT0603BRD0710KL; Power: 0.1Вт; Supplier 1: https://www.chipdip.ru/product/0.1vt-0603-10-kom-0.1-rt0603brd0710kl-chip-rezistor-yageo-9001548802
R9#1 = Res_0402: Резистор; Manufacturer Part Number: RC0402JR-070RL; Tolerance: 5%; Power: 0.062 Вт; Supplier 1: https://www.chipdip.ru/product/0.062w-0402-0-om-5
T1 = DLW21SN921SK2L: Ind Common Mode Choke Shielded Wirewound 920 Ohm 25% 100MHz 160mA 0805 Emboss T/R; Manufacturer: Murata; Impedance: 920R; Number of Lines: 2; Voltage Rating (DC): 50V; Supplier 1: https://www.chipdip.ru/product0/8004176754; Manufacturer Part Number: DLW21SN921SK2L; RoHS: Yes; Category: Common Mode Chokes; Stock 1: 6756; Pricing 1: 1=0,49, 10=0,358, 50=0,358, 100=0,258, 1000=0,22, 10000=0,186 (USD); Mount: Surface Mount; Min Operating Temperature: -40°C; Max Operating Temperature: 85°C; Packaging: Cut Tape; Max Current Rating: 160mA; Series: DLW21; Length: 2mm; Width: 1.2mm; RoHS Compliant: Yes; ComponentLink1URL: https://datasheet.octopart.com/DLW21SN921SK2L-Murata-datasheet-141273720.pdf?src-supplier=Element14; ComponentLink1Description: https://datasheet.octopart.com/DLW21SN921SK2L-Murata-datasheet-141273720.pdf?src-supplier=Element14; ComponentLink2URL: https://www.murata.com/en-us/products/productdata/8796756803614/EFLC0015.pdf?src-supplier=Digikey; ComponentLink2Description: https://www.murata.com/en-us/products/productdata/8796756803614/EFLC0015.pdf?src-supplier=Digikey; ComponentLink3URL: https://datasheet.octopart.com/DLW21SN921SK2L-Murata-datasheet-138902087.pdf?src-supplier=Future+Electronics; ComponentLink3Description: https://datasheet.octopart.com/DLW21SN921SK2L-Murata-datasheet-138902087.pdf?src-supplier=Future+Electronics; Supplier Part Number 1: 81-DLW21SN921SK2L
V1 = ESDCAN24-2BLY: TVS DIODE 24VWM 40VC SOT23-3L / ESD Suppressor Diode TVS Bi-Dir 24V Automotive 3-Pin SOT-23 T/R; Manufacturer: STMicroelectronics; Supplier 1: https://www.chipdip.ru/product/esdcan24-2bly-umw?from=suggest_product; Manufacturer Part Number: ESDCAN24-2BLY; RoHS: Yes; Category: TVS Diodes; Stock 1: 135000; Pricing 1: 3000=0,102, 6000=0,0993, 9000=0,064, 12000=0,0968, 15000=0,096, 30000=0,0613, 45000=0,0912, 60000=0,059 (USD); ComponentLink1URL: https://datasheet.ciiva.com/26935/getdatasheetpartid-779627-26935935.pdf?src-supplier=Verical; ComponentLink1Description: https://datasheet.ciiva.com/26935/getdatasheetpartid-779627-26935935.pdf?src-supplier=Verical; ComponentLink2URL: https://datasheet.ciiva.com/12070/dm00037599-100424-12070821.pdf?src-supplier=Mouser; ComponentLink2Description: https://datasheet.ciiva.com/12070/dm00037599-100424-12070821.pdf?src-supplier=Mouser; ComponentLink3URL: https://datasheet.ciiva.com/23803/dm00037599-23803632.pdf?src-supplier=Newark; ComponentLink3Description: https://datasheet.ciiva.com/23803/dm00037599-23803632.pdf?src-supplier=Newark; ComponentLink4URL: https://datasheet.ciiva.com/22685/1786030-22685811.pdf?src-supplier=Element14; ComponentLink4Description: https://datasheet.ciiva.com/22685/1786030-22685811.pdf?src-supplier=Element14; ComponentLink5URL: https://datasheet.ciiva.com/6574/dm00037599-6574397.pdf?src-supplier=Digikey; ComponentLink5Description: https://datasheet.ciiva.com/6574/dm00037599-6574397.pdf?src-supplier=Digikey; ComponentLink6URL: https://datasheet.ciiva.com/6574/dm00037599-6574398.pdf?src-supplier=Digikey; ComponentLink6Description: https://datasheet.ciiva.com/6574/dm00037599-6574398.pdf?src-supplier=Digikey; ComponentLink7URL: https://datasheet.ciiva.com/41443/001183991-da-01-en-tvs-diode-24-esdcan24-2bly-sot-23-3l-stm-41443402.pdf?src-supplier=Conrad; ComponentLink7Description: https://datasheet.ciiva.com/41443/001183991-da-01-en-tvs-diode-24-esdcan24-2bly-sot-23-3l-stm-41443402.pdf?src-supplier=Conrad; Supplier Part Number 1: 1027027
V2 = SM712.TCT: SM Series 12 V 400 W Asymmetrical TVS Diode for Extended Common-Mode - SOT-23; Manufacturer: Semtech; Direction: Bidirectional; Number of Elements: 2; Reverse Breakdown Voltage: 13.3V; Reverse Standoff Voltage: 12V; Min Breakdown Voltage: 7.5V; Clamping Voltage: 26V; Peak Pulse Power: 400W; Power Line Protection: No; Leakage Current: 1uA; Peak Pulse Current: 17A; Test Current: 1mA; ESD Protection: Yes; Max Reverse Leakage Current: 20uA; Diode Type: ZENER; Number of Channels: 2NUMBER; Supplier: Rs; Supplier Part Number: 6910811P; Manufacturer Part Number: SM712.TCT; RoHS: Yes; Category: TVS Diodes; Stock: 2025; Pricing: 25=0,92, 50=0,82, 125=0,726, 250=0,712 (GBP); Mounting Technology: Surface Mount; Case/Package: SOT-23; Pins: 3; Min Operating Temperature: -55°C; Max Operating Temperature: 125°C; Packaging: Tape and Reel; Number of Bidirectional Channels: 2; Power Dissipation: 400W; Polarity: Bidirectional; Working Voltage: 12V; Max Breakdown Voltage: 13.3V; Max Power Dissipation: 400W; Voltage Rating (DC): 12V; Series: -; Clamping Voltage-Max: 12V; Breakdown Voltage: 13.3V; Length: 2.9mm; Width: 1.3mm; Height: 0.95mm; Depth: 1.3mm; Radiation Hardening: No; Reach SVHC Compliant: No; Lead Free: Lead Free; RoHS Compliant: Yes; ComponentLink1URL: https://datasheet.ciiva.com/16393/sm712-16393584.pdf?src-supplier=Future+Electronics; ComponentLink1Description: https://datasheet.ciiva.com/16393/sm712-16393584.pdf?src-supplier=Future+Electronics; ComponentLink2URL: https://datasheet.ciiva.com/18065/getdatasheetpartid-110620-18065348.pdf?src-supplier=Verical; ComponentLink2Description: https://datasheet.ciiva.com/18065/getdatasheetpartid-110620-18065348.pdf?src-supplier=Verical; ComponentLink3URL: https://datasheet.ciiva.com/5748/579001-5748455.pdf?src-supplier=Farnell; ComponentLink3Description: https://datasheet.ciiva.com/5748/579001-5748455.pdf?src-supplier=Farnell; ComponentLink4URL: https://datasheet.ciiva.com/8029/579001-8029931.pdf?src-supplier=Element14; ComponentLink4Description: https://datasheet.ciiva.com/8029/579001-8029931.pdf?src-supplier=Element14; ComponentLink5URL: https://datasheet.ciiva.com/339/sm712-339089.pdf?src-supplier=Digikey; ComponentLink5Description: https://datasheet.ciiva.com/339/sm712-339089.pdf?src-supplier=Digikey; ComponentLink6URL: https://datasheet.ciiva.com/339/sm712-339090.pdf?src-supplier=Digikey; ComponentLink6Description: https://datasheet.ciiva.com/339/sm712-339090.pdf?src-supplier=Digikey; ComponentLink7URL: https://datasheet.ciiva.com/339/sm712-339091.pdf?src-supplier=Digikey; ComponentLink7Description: https://datasheet.ciiva.com/339/sm712-339091.pdf?src-supplier=Digikey; Supplier 1: https://www.chipdip.ru/product/sm712.tct
VD1#1 = Д814Д: Стабилитрон кремниевый, 12В; Supplier 1: https://www.chipdip.ru/product/d814d-metall-stabilitron-kremnievyy-12v-sztp-9000500630?from=rec_product_auto
VD2#1 = BAV199: Диод импульсный, 2 х 0.215/0.3А, 85В, последовательное включение; Supplier 1: https://www.chipdip.ru/product/bav199-diod-impulsnyy-2-h-0.215-0.3a-85v-diotec-9000854588
X1-X3 = DG308-2.54-03P: Клеммник 3 конт. шаг 2.54 мм, вертик. на плату, H = 8.5 мм, провод под винт/микролифт (пров. 26-18AWG/ до 1.0 кв.мм), до 150В/6А, зеленый изол.; Supplier 1: https://www.chipdip.ru/product/308-031-14-dg308-2.54-03p-klemmnik-vintovoy-xinya-xinlaiya-10706
X4 X5#1 = DS1021-1x5: Штыри однорядные 1x5 конт. шаг 2.54 мм; Supplier 1: https://www.chipdip.ru/product/pls-5
Z1 = ABM11-25.000MHZ-D2X-T: Crystal 25MHz ±20ppm (Tol) ±20ppm (Stability) 10pF FUND 100Ohm 4-Pin Ultra Mini-CSMD T/R; Manufacturer: Abracon; Supplier 1: https://www.chipdip.ru/product0/8009921874; Supplier Part Number: ABM11-25.000MHZ-D2X-T; Manufacturer Part Number: ABM11-25.000MHZ-D2X-T; RoHS: No; Category: Crystals and Oscillators; Stock: 4570; Pricing: 259=0,3855, 500=0,3667, 1000=0,363, 2000=0,3516, 5000=0,3277 (USD); ComponentLink1URL: https://datasheet.octopart.com/ABM11-25.000MHZ-D2X-T-Abracon-datasheet-12518431.pdf?src-supplier=Sager+Electronics; ComponentLink1Description: https://datasheet.octopart.com/ABM11-25.000MHZ-D2X-T-Abracon-datasheet-12518431.pdf?src-supplier=Sager+Electronics